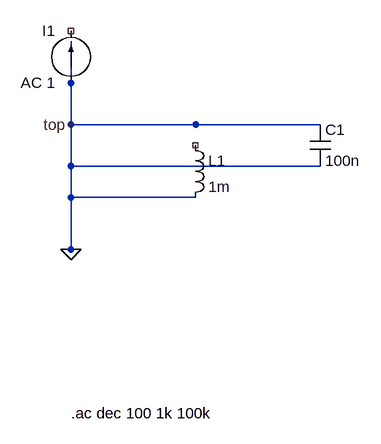
[diagram p0: schematic test03_parallel_lc.asc]
test03_parallel_lc.asc, the LTspice schematic file:
Version 4
SHEET 1 880 736
WIRE 0 64 0 384
WIRE 192 192 0 192
WIRE 192 304 0 304
WIRE 0 304 0 384
WIRE 384 192 0 192
WIRE 384 256 0 256
WIRE 0 256 0 384
FLAG 0 384 0
FLAG 0 192 top
SYMBOL current 0 128 R180
WINDOW 0 24 80 Left 2
WINDOW 3 24 0 Left 2
SYMATTR InstName I1
SYMATTR Value AC 1
SYMBOL ind 176 208 R0
SYMATTR InstName L1
SYMATTR Value 1m
SYMBOL cap 368 192 R0
SYMATTR InstName C1
SYMATTR Value 100n
TEXT 0 636 Left 2 !.ac dec 100 1k 100k

The netlist it stands for:
* test03_parallel_lc.asc
I1 0 NC_01 AC 1
L1 NC_02 0 1m
C1 0 0 100n
.ac dec 100 1k 100k
.backanno
.end